# EasyEDA Pro project 能量机关测试板.eprj

# Schematic Schematic1
Create Date: 2023-03-18; Page Name: P1; Project Name: 能量机关测试板; Schematic Name: Schematic1; Update Date: 2023-03-19; Company: 嘉立创EDA; Page Size: A3; Version: V1.0
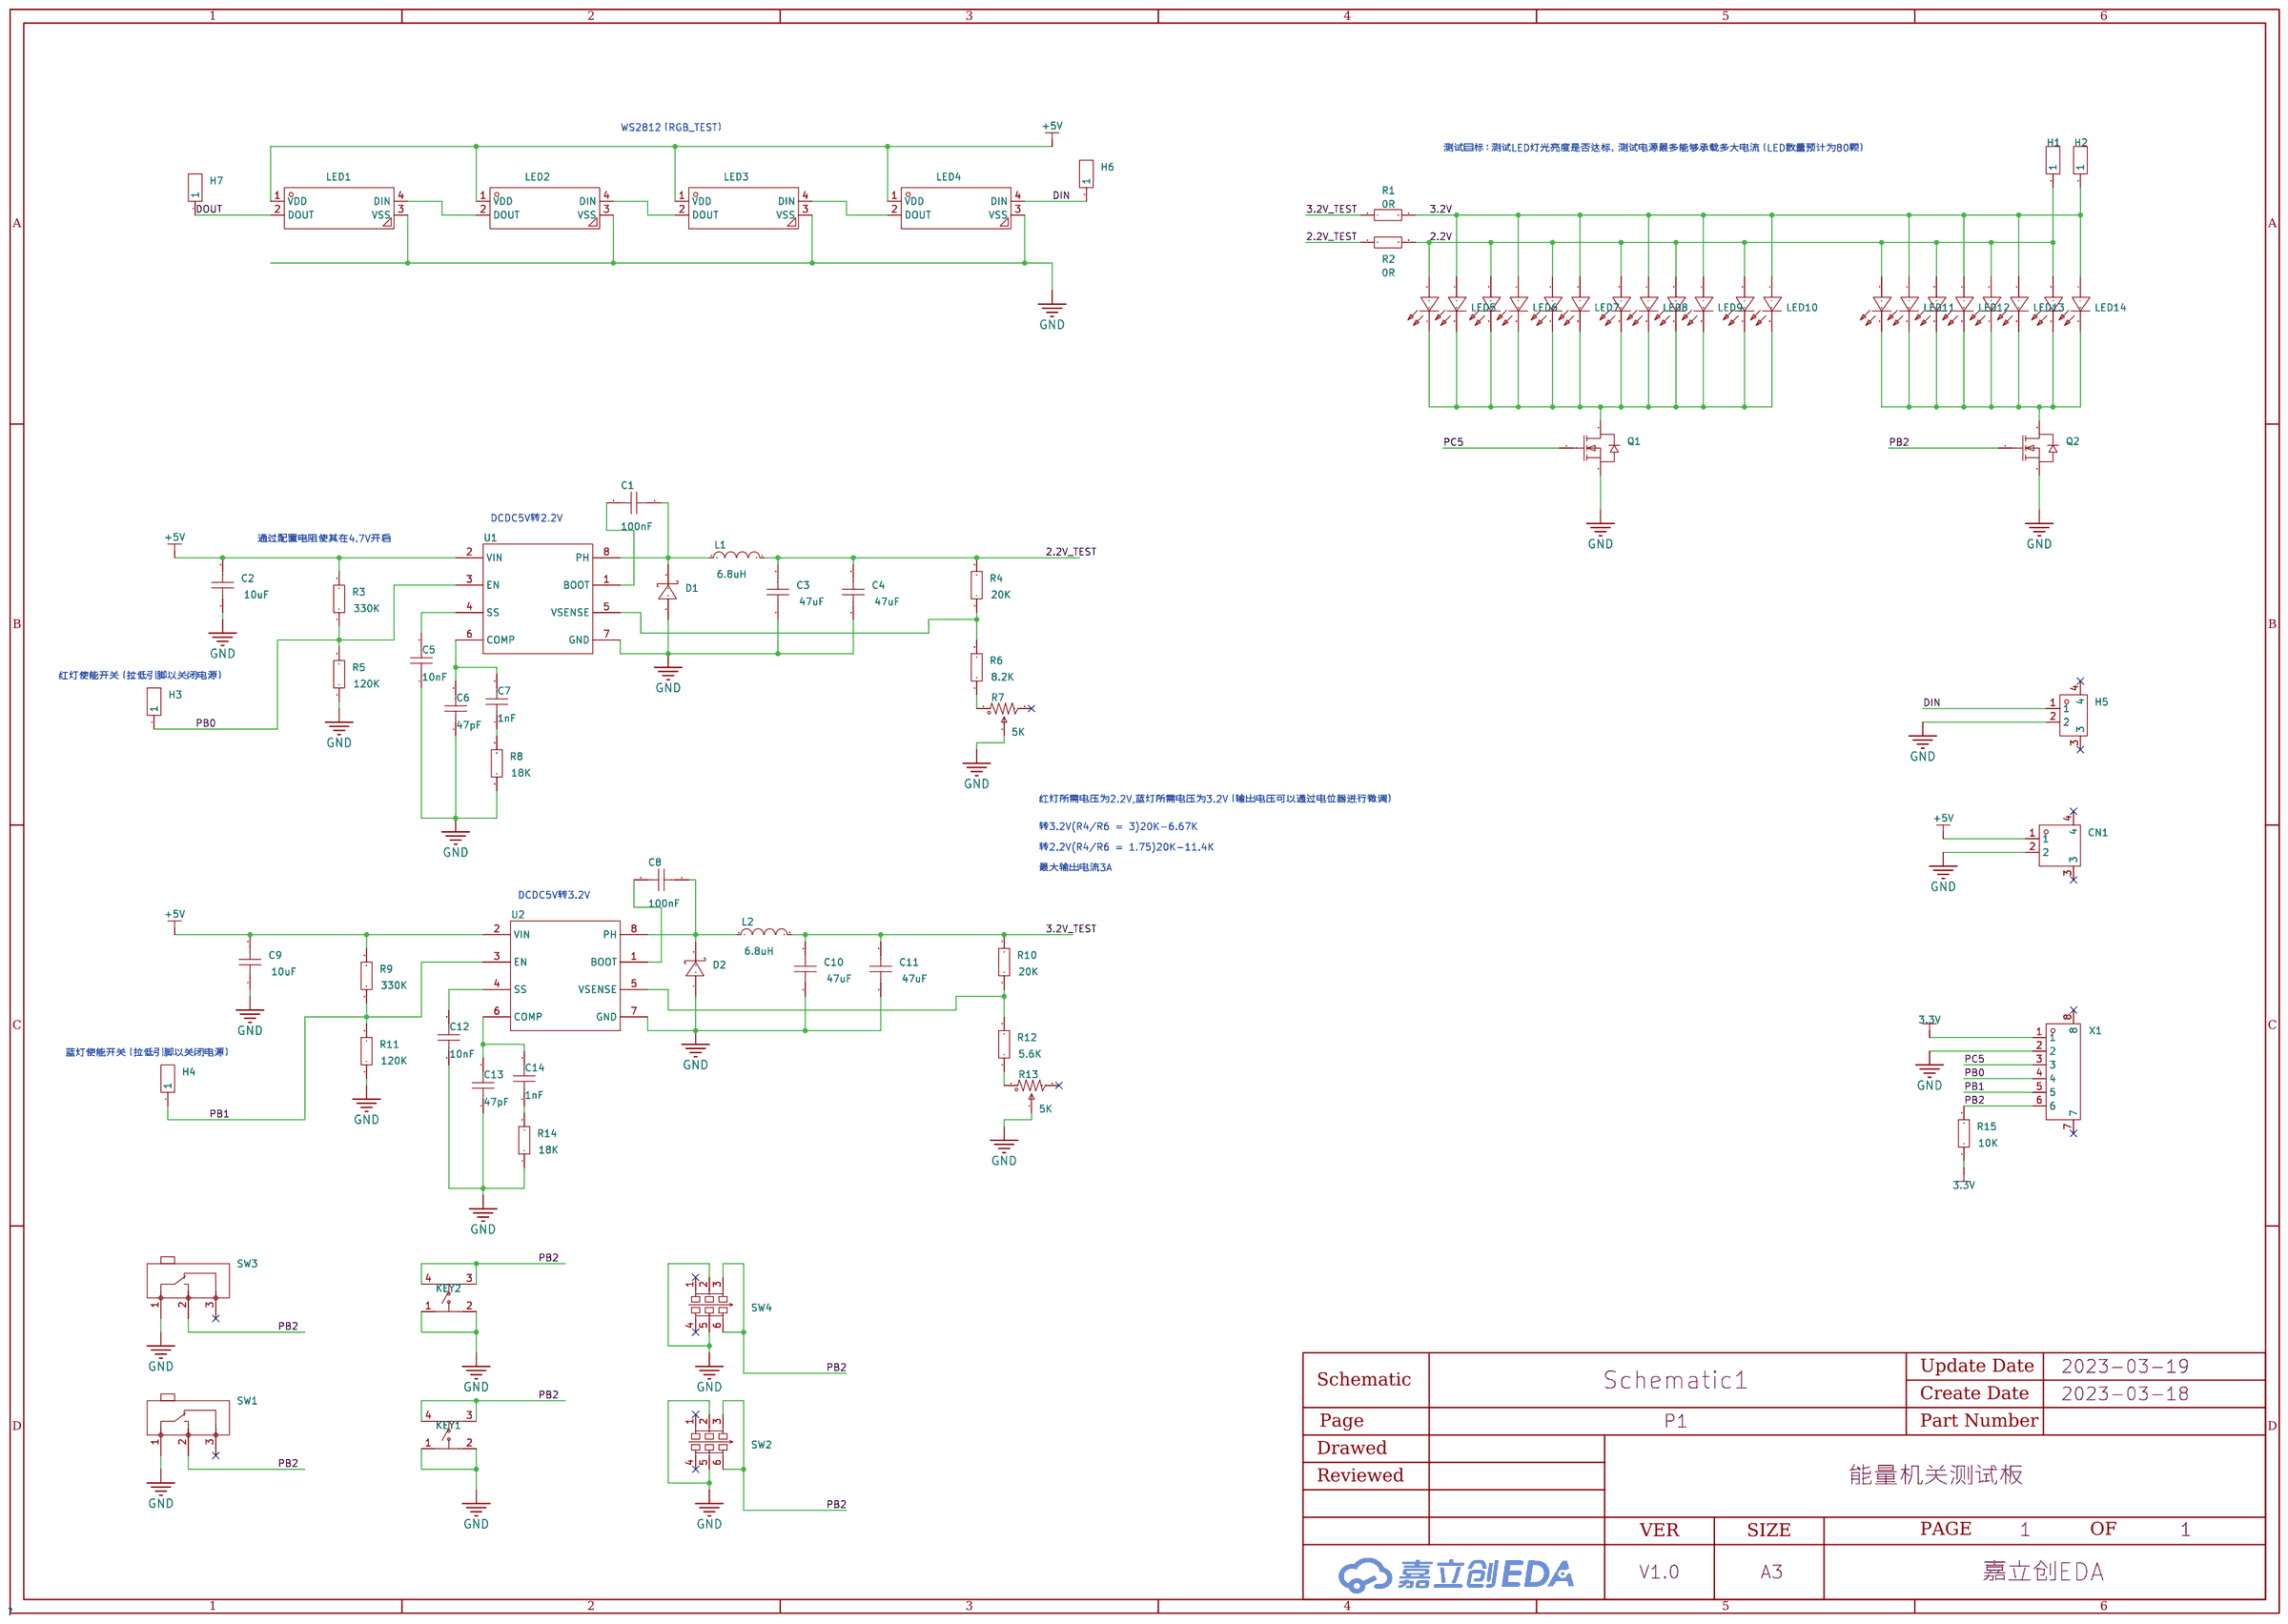
[diagram p0: schematic sheet]

## Parts
C1  100nF  [C0603]
C2  10uF  [C0603]
C3  47uF  [C1206]
C4  47uF  [C1206]
C5  10nF  [C0603]
C6  47pF  [C0603]
C7  1nF  [C0603]
C8  100nF  [C0603]
C9  10uF  [C0603]
C10  47uF  [C1206]
C11  47uF  [C1206]
C12  10nF  [C0603]
C13  47pF  [C0603]
C14  1nF  [C0603]
CN1  XT30PW-M  [CONN-TH_XT30PW-M]
D1  SS54  [SMA_L4.4-W2.8-LS5.4-R-RD]
D2  SS54  [SMA_L4.4-W2.8-LS5.4-R-RD]
H1  -  [HDR-TH_1P-V-M_XKB_X4611WV-01I-C28D40]
H2  -  [HDR-TH_1P-V-M_XKB_X4611WV-01I-C28D40]
H3  -  [HDR-TH_1P-V-M_XKB_X4611WV-01I-C28D40]
H4  -  [HDR-TH_1P-V-M_XKB_X4611WV-01I-C28D40]
H5  GH1.25-2PWBPZ  [CONN-SMD_GH1.25-2PWBPZ]
H6  -  [HDR-TH_1P-V-M_XKB_X4611WV-01I-C28D40]
H7  -  [HDR-TH_1P-V-M_XKB_X4611WV-01I-C28D40]
KEY1  B3F-4055  [KEY-TH_4P-L12.0-W12.0-P5.00-LS13.4-EH]
KEY2  B3F-4055  [KEY-TH_4P-L12.0-W12.0-P5.00-LS13.4-EH]
L1  6.8uH  [IND-SMD_L4.4-W4.2]
L2  6.8uH  [IND-SMD_L4.4-W4.2]
LED1  WS2812E  [LED-SMD_4P-L5.0-W5.0-BL_TC5050RGB]
LED2  WS2812E  [LED-SMD_4P-L5.0-W5.0-BL_TC5050RGB]
LED3  WS2812E  [LED-SMD_4P-L5.0-W5.0-BL_TC5050RGB]
LED4  WS2812E  [LED-SMD_4P-L5.0-W5.0-BL_TC5050RGB]
LED5  XL-3528SURUBC  [LED-SMD_4P-L3.2-W2.8-LS3.5-TL]
LED6  XL-3528SURUBC  [LED-SMD_4P-L3.2-W2.8-LS3.5-TL]
LED7  XL-3528SURUBC  [LED-SMD_4P-L3.2-W2.8-LS3.5-TL]
LED8  XL-3528SURUBC  [LED-SMD_4P-L3.2-W2.8-LS3.5-TL]
LED9  XL-3528SURUBC  [LED-SMD_4P-L3.2-W2.8-LS3.5-TL]
LED10  XL-3528SURUBC  [LED-SMD_4P-L3.2-W2.8-LS3.5-TL]
LED11  XL-3528SURUBC  [LED-SMD_4P-L3.2-W2.8-LS3.5-TL]
LED12  XL-3528SURUBC  [LED-SMD_4P-L3.2-W2.8-LS3.5-TL]
LED13  XL-3528SURUBC  [LED-SMD_4P-L3.2-W2.8-LS3.5-TL]
LED14  XL-3528SURUBC  [LED-SMD_4P-L3.2-W2.8-LS3.5-TL]
Q1  AO3400A  [SOT-23-3_L2.9-W1.6-P1.90-LS2.8-BR]
Q2  AO3400A  [SOT-23-3_L2.9-W1.6-P1.90-LS2.8-BR]
R1  0R  [R0805]
R2  0R  [R0805]
R3  330K  [R0603]
R4  20K  [R0603]
R5  120K  [R0603]
R6  8.2K  [R0603]
R7  5K  [RES-ADJ-SMD_3P-L3.0-W3.8-P1.75-BR]
R8  18K  [R0603]
R9  330K  [R0603]
R10  20K  [R0603]
R11  120K  [R0603]
R12  5.6K  [R0603]
R13  5K  [RES-ADJ-SMD_3P-L3.0-W3.8-P1.75-BR]
R14  18K  [R0603]
R15  10K  [R0603]
SW1  D2F-F  [SW-TH_D2F-F]
SW2  BTSA-L-P-16  [SW-TH_BTSA-X-P-16]
SW3  D2F-F  [SW-TH_D2F-F]
SW4  BTSA-L-P-16  [SW-TH_BTSA-X-P-16]
U1  TPS54331DR  [SOIC-8_L5.0-W4.0-P1.27-LS6.0-BL]
U2  TPS54331DR  [SOIC-8_L5.0-W4.0-P1.27-LS6.0-BL]
X1  GH125-S06DCA-00  [CONN-SMD_6P-P1.25_JUSHUO_GH125-S06DCA-00]

## Library data of the parts
C1 C5-C9 C12-C14 = CAP_0603: Supplier Footprint: 0603
C2 = CL10A106MA8NRNC: 容值:10uF;精度:±20%;额定电压:25V;材质(温度系数):X5R;; LCSC Part Name: 10uF ±20% 25V; Supplier Part: C96446; Manufacturer: SAMSUNG(三星); Supplier Footprint: 0603; JLCPCB Part Class: Basic Part; Datasheet: https://atta.szlcsc.com/upload/public/pdf/source/20170325/1490427913016.pdf; Supplier: LCSC; Tolerance: ±20%; Voltage Rated: 25V; Temperature Coefficient: X5R
C3 C4 C10 C11 = CL31A476MPHNNNE: 容值:47uF;精度:±20%;额定电压:10V;材质(温度系数):X5R;; LCSC Part Name: 47uF ±20% 10V; Supplier Part: C96123; Manufacturer: SAMSUNG(三星); Supplier Footprint: 1206; JLCPCB Part Class: Basic Part; Datasheet: https://atta.szlcsc.com/upload/public/pdf/source/20170228/1488267692219.pdf; Supplier: LCSC; Tolerance: ±20%; Voltage Rated: 10V; Temperature Coefficient: X5R
CN1 = XT30PW-M: Socket,DCsupply,XT30,male,PIN:2; LCSC Part Name: XT30PW-M公头; Supplier Part: C431092; Manufacturer: AMASS(艾迈斯); Supplier Footprint: 插件; JLCPCB Part Class: Extended Part; Datasheet: https://atta.szlcsc.com/upload/public/pdf/source/20220222/6A9F22F7850E25B33E1BE430ADF8560B.pdf; Supplier: LCSC
D1 D2 = SS54_C22452: 直流反向耐压(Vr):40V;平均整流电流(Io):5A;正向压降(Vf):550mV@5A;; LCSC Part Name: 40V 5A 550mV@5A; Supplier Part: C22452; Manufacturer: MDD; Supplier Footprint: SMA(DO-214AC); JLCPCB Part Class: Basic Part; Datasheet: https://atta.szlcsc.com/upload/public/pdf/source/20230314/529CD85F9B31F69841D3A079BC07E377.pdf; Supplier: LCSC; Reverse Voltage (Vr): 40V; Average Rectified Current (Io): 5A; Forward Voltage (Vf@If): 550mV@5A
H1-H4 H6 H7 = HDR-M_2.54_1x1P: Supplier Part: C81276; Supplier Footprint: 插件; JLCPCB Part Class: Extended Part
H5 = GH1.25-2PWBPZ: LCSC Part Name: GH1.25-2P卧贴编带; Supplier Part: C2829251; Manufacturer: BOOMELE(博穆精密); JLCPCB Part Class: Extended Part; Datasheet: https://atta.szlcsc.com/upload/public/pdf/source/20211125/08A09A4909F58AF780B71FE423A00F7E.pdf; Supplier: LCSC
KEY1 KEY2 = B3F-4055_C84931: 触点电流:50mA;额定电压(DC):24V;电路结构:单刀单掷;安装方式:直插;按钮形状:方形按钮;带灯:-;开关长度:12mm;开关宽度:12mm;开关高度:7.3mm;; LCSC Part Name: 轻触开关，1212x7.3，操作力:2.55N，行程:0.3mm; Supplier Part: C84931; Manufacturer: OMRON(欧姆龙); Supplier Footprint: 插件; JLCPCB Part Class: Extended Part; Datasheet: https://atta.szlcsc.com/upload/public/pdf/source/20161024/1477288679265.pdf; Supplier: LCSC; Contact Current: 50mA; Voltage Rating (DC): 24V; Circuit: 单刀单掷; Mounting Style: 直插; Actuator Style: 方形按钮; Switch Length: 12mm; Switch Width: 12mm; Switch Height: 7.3mm
L1 L2 = SLO0420H6R8MTT: 电感值:6.8uH;精度:±20%;额定电流:-;直流电阻(DCR):-;; LCSC Part Name: 6.8uH ±20%; Supplier Part: C207831; Manufacturer: Sunltech(韩国顺磁); Supplier Footprint: SMD; JLCPCB Part Class: Extended Part; Datasheet: https://atta.szlcsc.com/upload/public/pdf/source/20181213/C207831_9CE68140B4A4D6C1F5B22F7A0B1543CF.pdf; Supplier: LCSC; Tolerance: ±20%
LED1-LED4 = WS2812E: 发光颜色:RGB三色;透镜颜色:无色透明;; LCSC Part Name: RGB三色 （注意防潮，请查阅规格书中对应具体内容）; Supplier Part: C139127; Manufacturer: worldsemi; Supplier Footprint: SMD5050; JLCPCB Part Class: Extended Part; Datasheet: https://atta.szlcsc.com/upload/public/pdf/source/20190919/C139127_8A00227E116D2190DD4F641BBD4AB378.pdf; Supplier: LCSC; Emitted Color: RGB三色; Lens Color: 无色透明
LED5-LED14 = XL-3528SURUBC: 发光颜色:红灯,蓝灯;二极管配置:-;透镜颜色:无色透明;主波长:462.5nm~465nm；620nm~625nm;峰值波长:625nm；465nm;测试电流:30mA;功率:90mW；90mW;发光角度:120°;安装方式:正贴;工作温度:-30℃~+85℃;; LCSC Part Name: 红灯,蓝灯 462.5nm~465nm 620nm~625nm 正贴 （同极性脚位）; Supplier Part: C2843811; Manufacturer: XINGLIGHT(成兴光); Supplier Footprint: SMD3528; JLCPCB Part Class: Extended Part; Datasheet: https://atta.szlcsc.com/upload/public/pdf/source/20221102/213A0B15308BC841DAD2CFA01F42E005.pdf; Supplier: LCSC; Emitted Color: 红灯,蓝灯; Lens Color: 无色透明; Dominant Wavelength: 462.5nm~465nm；620nm~625nm; Peak Wavelength: 625nm；465nm; Forward Current: 30mA; Power Dissipation: 90mW；90mW; Viewing Angle: 120°; Mounting Sytle: 正贴; Operating Temperature: -30℃~+85℃
Q1 Q2 = AO3400A_C20917: 类型:N沟道;漏源电压(Vdss):30V;连续漏极电流(Id):5.7A;功率(Pd):1.4W;导通电阻(RDS(on)@Vgs,Id):26.5mΩ@10V,5.7A;阈值电压(Vgs(th)@Id):1.5V@250uA;; LCSC Part Name: N沟道 30V 5.7A; Supplier Part: C20917; Manufacturer: AOS; Supplier Footprint: SOT-23-3L; JLCPCB Part Class: Basic Part; Datasheet: https://atta.szlcsc.com/upload/public/pdf/source/20140107/1457706668533.pdf; Supplier: LCSC; Type: N沟道; Drain Source Voltage (Vdss): 30V; Continuous Drain Current (Id): 5.7A; Power Dissipation (Pd): 1.4W; Drain Source On Resistance (RDS(on)@Vgs,Id): 26.5mΩ@10V,5.7A; Gate Threshold Voltage (Vgs(th)@Id): 1.5V@250uA
R1 R2 = Res_0805: Supplier Footprint: 0805
R3-R6 R8-R12 R14 R15 = Res_0603: Supplier Footprint: 0603
R7 R13 = TC33X-2-103E: 阻值:10kΩ;精度:±25%;功率:150mW;圈数:-;额定电压:-;; LCSC Part Name: 10kΩ ±25%; Supplier Part: C719176; Manufacturer: BOURNS; Supplier Footprint: SMD; JLCPCB Part Class: Extended Part; Datasheet: https://atta.szlcsc.com/upload/public/pdf/source/20200810/C720646_BB66A75E654D5E1D30127FF45BCD3C26.pdf; Supplier: LCSC; Tolerance: ±25%; Power(Watts): 150mW
SW1 SW3 = D2F-F: 额定电流(DC):-;额定电压(DC):-;额定电流(AC):1A;额定电压(AC):125V;电路结构:单刀双掷;; LCSC Part Name: D2F-F/微动开关; Supplier Part: C87496; Manufacturer: OMRON(欧姆龙); Supplier Footprint: 插件; JLCPCB Part Class: Extended Part; Datasheet: https://atta.szlcsc.com/upload/public/pdf/source/20170221/1487673193635.pdf; Supplier: LCSC; Contact Current (AC): 1A; Voltage Rating (AC): 125V; Circuit: 单刀双掷
SW2 SW4 = BTSA-L-P-16: 触点电流:100mA;额定电压 (AC):-;额定电压 (DC):-;绝缘电阻:100MΩ;电路结构:-;安装方式:直插;自锁/无锁:自锁;按键形状:方形按钮;按键/盖帽颜色:蓝色;带灯:无;引脚样式:PC引脚;作用力:250gf@±50gf;防护等级:-;工作温度:-20℃~+70℃;机械寿命:10000;; Supplier Part: C2693640; Manufacturer: ROCPU Switches(台普); Supplier Footprint: 插件; JLCPCB Part Class: Extended Part; Datasheet: https://atta.szlcsc.com/upload/public/pdf/source/20210317/C2693625_B3D83B78D2512AD179A7F987F25D7A8F.pdf; Supplier: LCSC; Contact Current: 100mA; Insulation Resistance: 100MΩ; Mounting Style: 直插; Self Lock / No Lock: 自锁; Actuator Style: 方形按钮; Actuator/Cap Color: 蓝色; With Lamp: 无; Pin Style: PC引脚; Operating Force: 250gf@±50gf; Operating Temperature: -20℃~+70℃; Mechanical Life: 10000
U1 U2 = TPS54331DR: 功能类型:降压型;同步整流:-;输出通道数:-;拓扑结构:-;输入电压:-;输出电流(最大值):-;开关频率:-;; LCSC Part Name: 降压型; Supplier Part: C9865; Manufacturer: TI(德州仪器); Supplier Footprint: SOIC-8-150mil; JLCPCB Part Class: Basic Part; Datasheet: https://atta.szlcsc.com/upload/public/pdf/source/20121112/1457706556448.pdf; Supplier: LCSC; Function: 降压型
X1 = GH125-S06DCA-00: 参考系列:GH;间距:1.25mm;插针结构:1x6P;排数:1;每排PIN数:6;行距:-;公母:公型插针;安装方式:卧贴;额定电流:1A;工作温度范围:-25℃~+85℃;; LCSC Part Name: GH1.25卧式贴片 带扣; Supplier Part: C2886769; Manufacturer: JS(钜硕电子); Supplier Footprint: SMD,P=1.25mm; JLCPCB Part Class: Extended Part; Datasheet: https://atta.szlcsc.com/upload/public/pdf/source/20210818/CD11791E5ED3EDF45A7009E9C8A2BD4C.pdf; Supplier: LCSC; Reference Series: GH; Pitch: 1.25mm; Pins Structure: 1x6P; Number of Rows: 1; Number of PINs Per Row: 6; Gender: 公型插针; Mounting Style: 卧贴; Current Rating (Max): 1A; Operating Temperature Range: -25℃~+85℃

## Nets
2.2V: H1.1 LED5.2 LED6.2 LED7.2 LED8.2 LED9.2 LED10.2 LED11.2 LED12.2 LED13.2 LED14.2 R2.2
2.2V_TEST: C3.2 C4.2 L1.2 R2.1 R4.2
3.2V: H2.1 LED5.4 LED6.4 LED7.4 LED8.4 LED9.4 LED10.4 LED11.4 LED12.4 LED13.4 LED14.4 R1.2
3.2V_TEST: C10.2 C11.2 L2.2 R1.1 R10.2
3.3V: R15.1 X1.1
+5V: C2.2 C9.2 CN1.1 LED1.1(VDD) LED2.1(VDD) LED3.1(VDD) LED4.1(VDD) R3.2 R9.2 U1.2(VIN) U2.2(VIN)
GND: C2.1 C3.1 C4.1 C5.1 C6.1 C9.1 C10.1 C11.1 C12.1 C13.1 CN1.2 D1.1(A) D2.1(A) H5.2 KEY1.1 KEY1.2 KEY2.1 KEY2.2 LED1.3(VSS) LED2.3(VSS) LED3.3(VSS) LED4.3(VSS) Q1.2(S) Q2.2(S) R5.1 R7.2 R8.1 R11.1 R13.2 R14.1 SW1.1 SW2.2 SW2.5 SW3.1 SW4.2 SW4.5 U1.7(GND) U2.7(GND) X1.2
DIN: H5.1 H6.1 LED4.4(DIN)
DOUT: H7.1 LED1.2(DOUT)
PB0: H3.1 R3.1 R5.2 U1.3(EN) X1.4
PB1: H4.1 R9.1 R11.2 U2.3(EN) X1.5
PB2: KEY1.3 KEY1.4 KEY2.3 KEY2.4 Q2.1(G) R15.2 SW1.2 SW2.3 SW2.6 SW3.2 SW4.3 SW4.6 X1.6
PC5: Q1.1(G) X1.3
$1N7140: LED1.4(DIN) LED2.2(DOUT)
$1N7163: LED2.4(DIN) LED3.2(DOUT)
$1N7186: LED3.4(DIN) LED4.2(DOUT)
$1N21476: C5.2 U1.4(SS)
$1N21483: R4.1 R6.2 U1.5(VSENSE)
$1N21484: C1.2 U1.1(BOOT)
$1N21485: C1.1 D1.2(K) L1.1 U1.8(PH)
$1N21486: R6.1 R7.1
$1N21488: C6.2 C7.2 U1.6(COMP)
$1N21489: C7.1 R8.2
$1N22401: C12.2 U2.4(SS)
$1N22408: R10.1 R12.2 U2.5(VSENSE)
$1N22409: C8.2 U2.1(BOOT)
$1N22410: C8.1 D2.2(K) L2.1 U2.8(PH)
$1N22411: R12.1 R13.1
$1N22413: C13.2 C14.2 U2.6(COMP)
$1N22414: C14.1 R14.2
$1N27439: LED5.1 LED5.3 LED6.1 LED6.3 LED7.1 LED7.3 LED8.1 LED8.3 LED9.1 LED9.3 LED10.1 LED10.3 Q1.3(D)
$1N27600: LED11.1 LED11.3 LED12.1 LED12.3 LED13.1 LED13.3 LED14.1 LED14.3 Q2.3(D)

Not connected (* = marked no-connect by the designer): CN1 3* 4*; H5 3* 4*; R7 3*; R13 3*; SW1 3*; SW2 1* 4*; SW3 3*; SW4 1* 4*; X1 7* 8*

## Notes on the sheet
- WS2812（RGB_TEST）
- 测试目标：测试LED灯光亮度是否达标，测试电源最多能够承载多大电流（LED数量预计为80颗）
- DCDC5V转2.2V
- 通过配置电阻使其在4.7V开启
- 红灯使能开关（拉低引脚以关闭电源）
- 红灯所需电压为2.2V,蓝灯所需电压为3.2V（输出电压可以通过电位器进行微调）
- 转3.2V(R4/R6 = 3)20K-6.67K
- 转2.2V(R4/R6 = 1.75)20K-11.4K
- 最大输出电流3A
- DCDC5V转3.2V
- 蓝灯使能开关（拉低引脚以关闭电源）

# Board PCB1
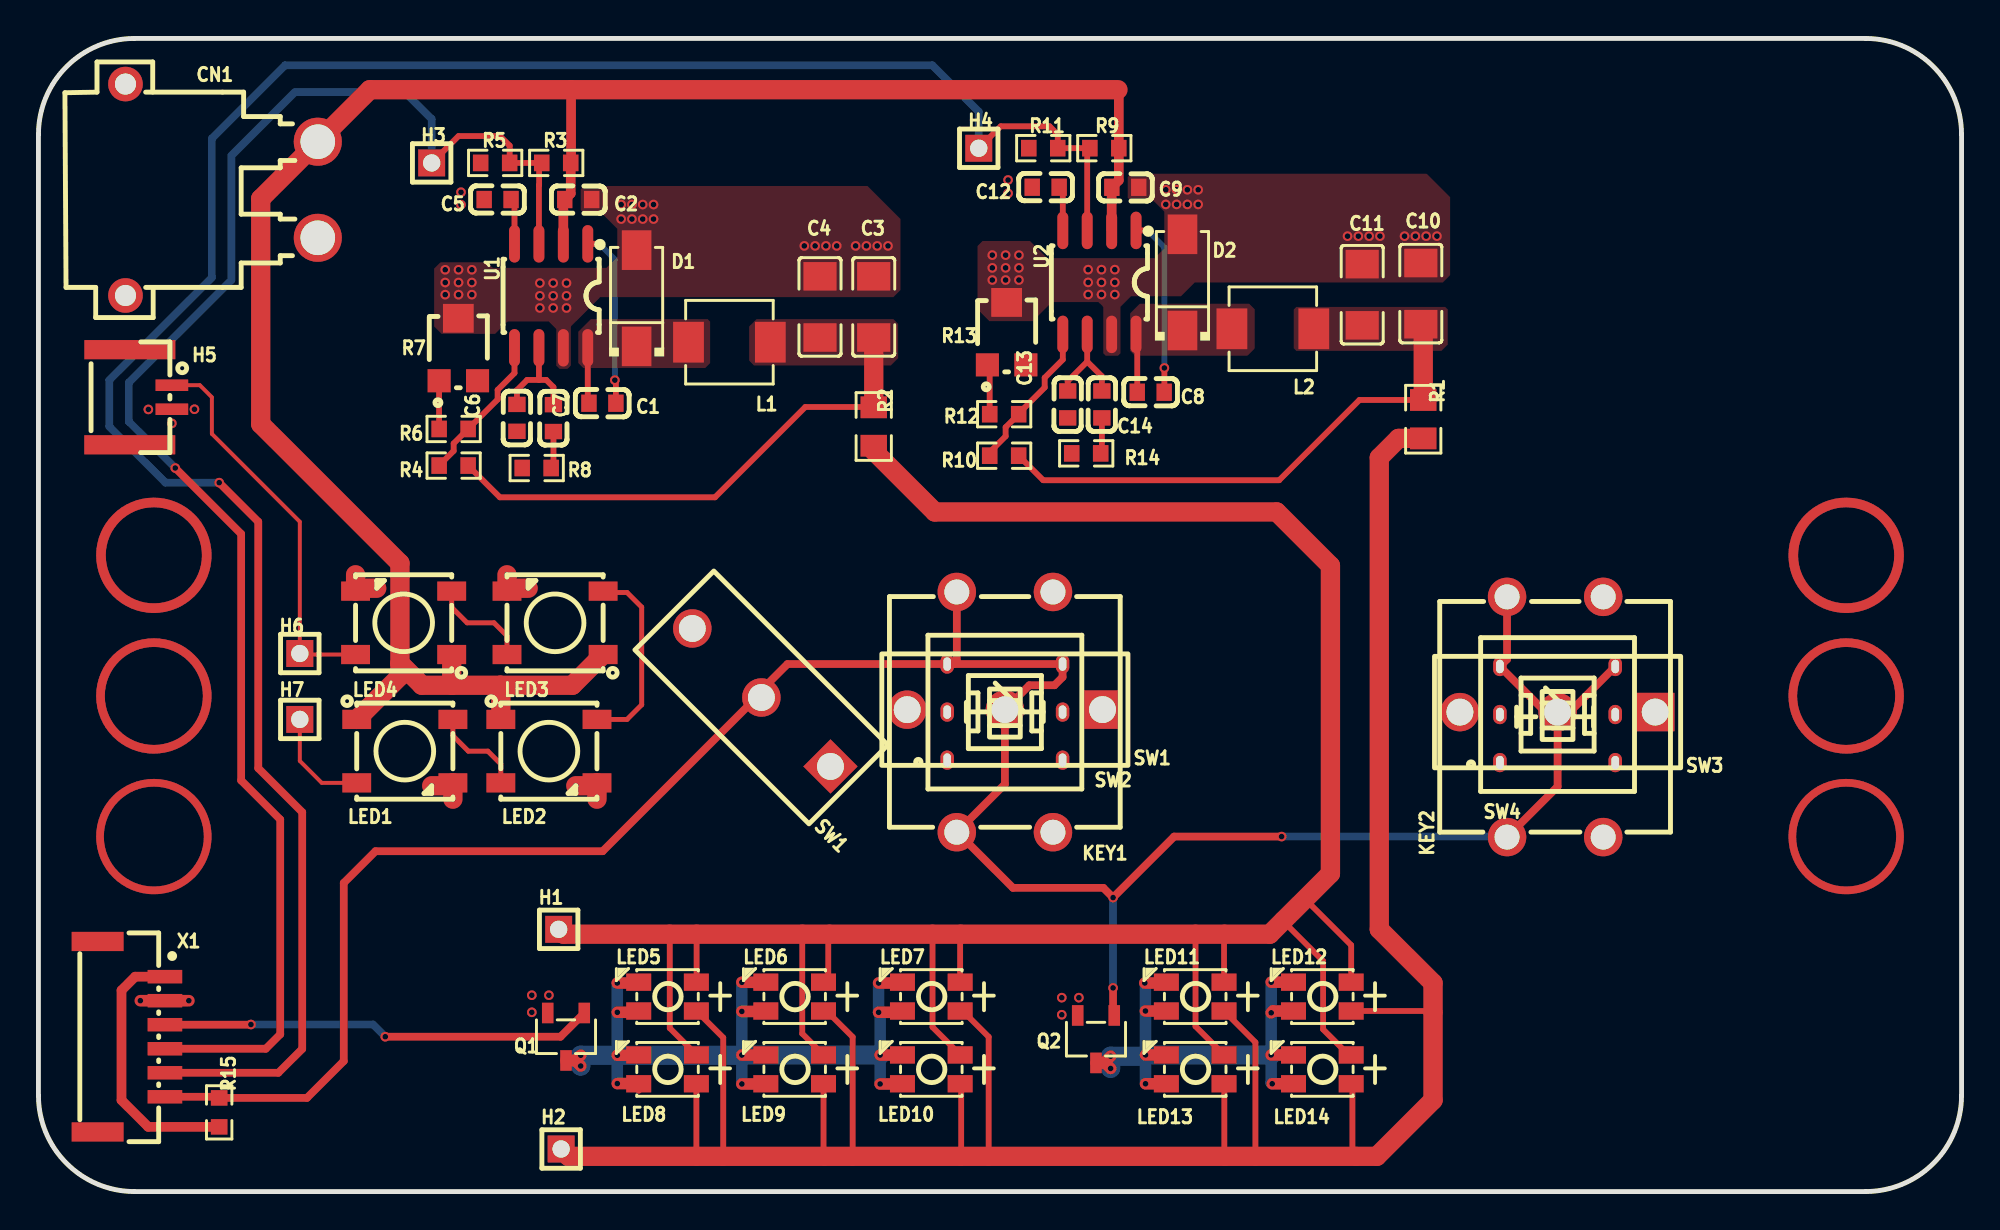
[diagram p1: board, top side]
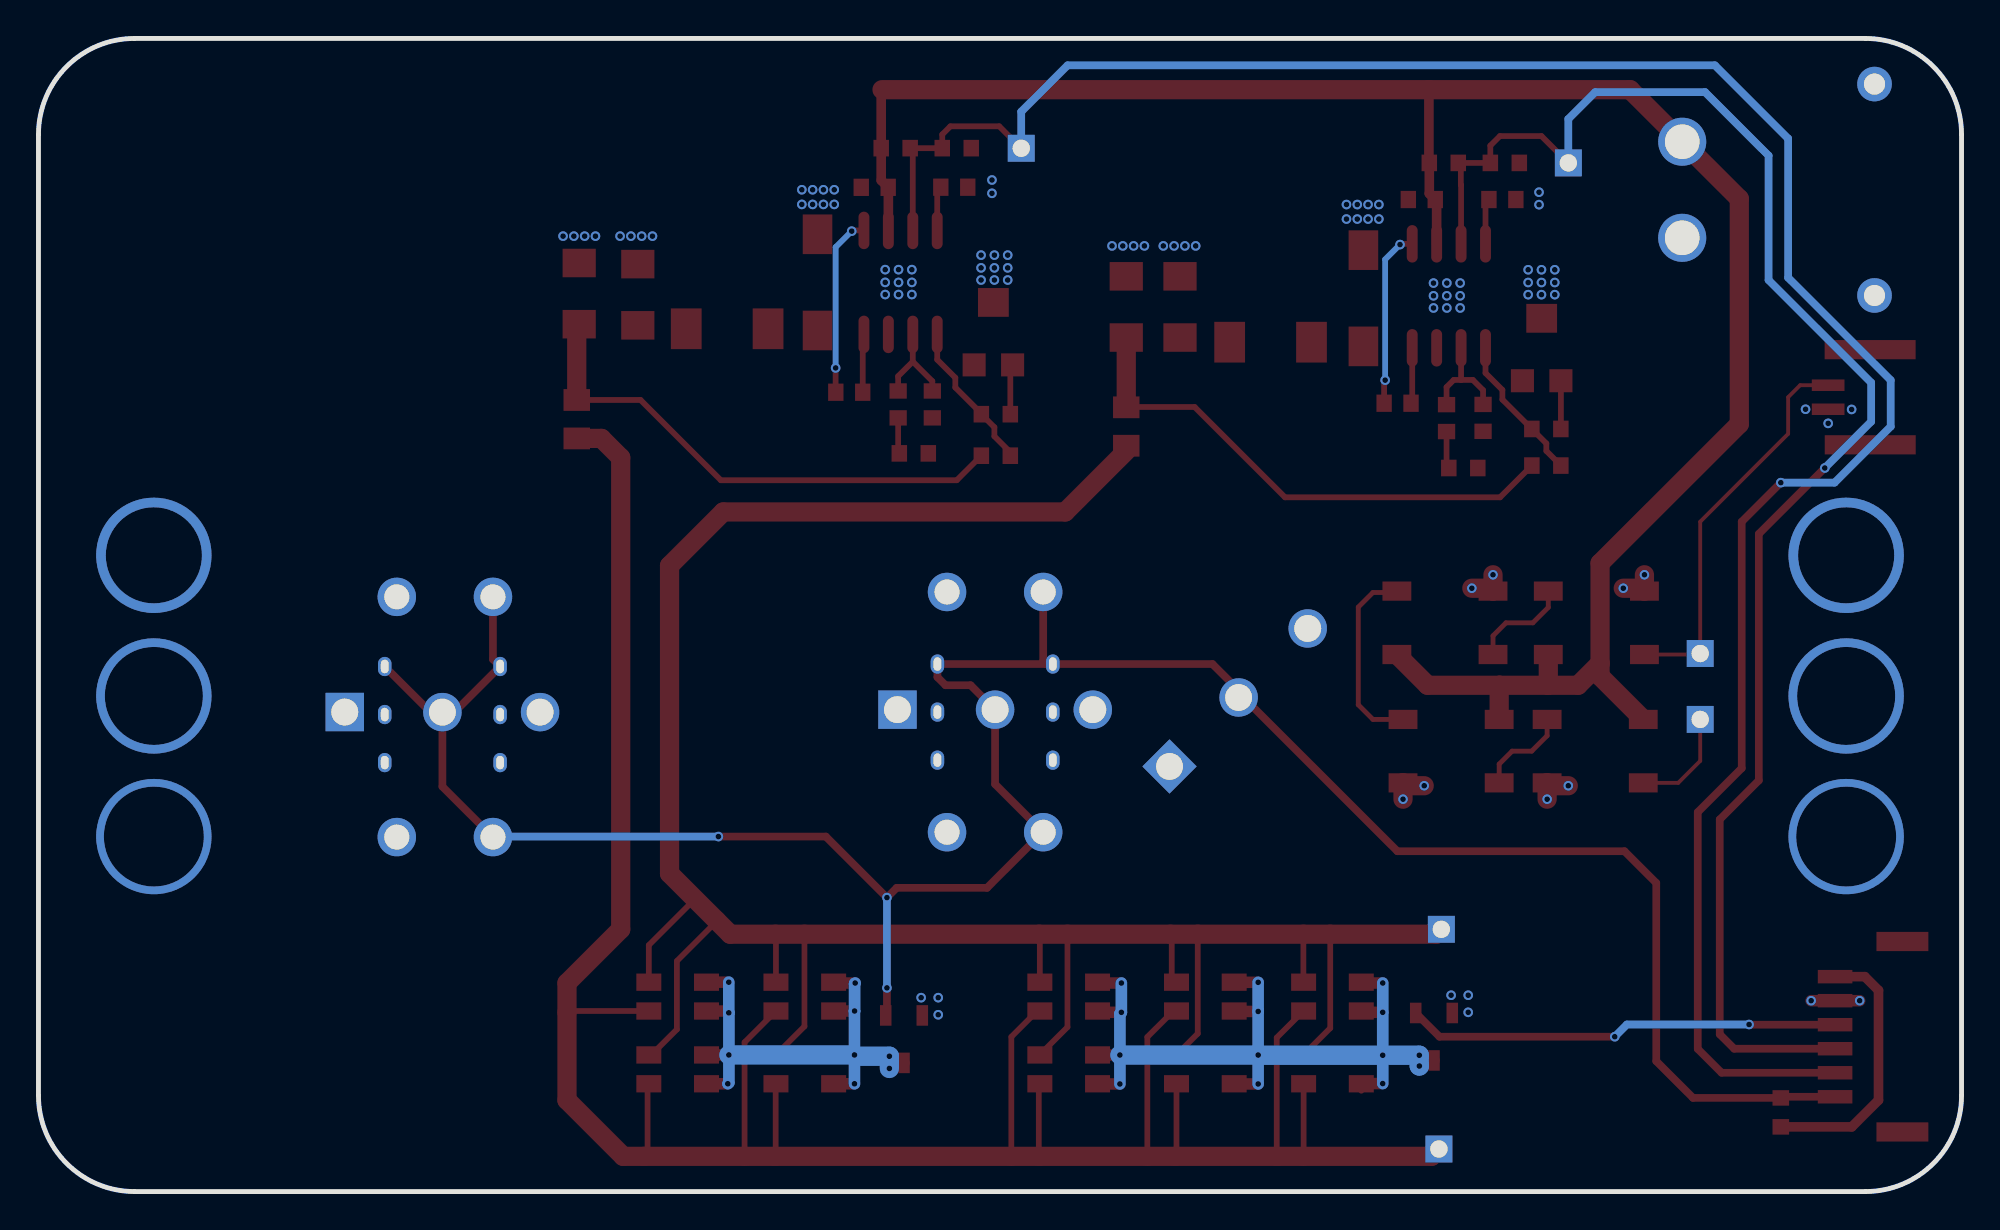
[diagram p2: board, bottom side, seen from below]

Outline 100 x 60 mm; copper layers: Top Layer, Bottom Layer. Coordinates in mm from the lower left corner of the outline.
Outline path: 0,55 0,5 arc(1.46,1.46) 5,0 95,0 arc(98.54,1.46) 100,5 100,55 arc(98.54,58.54) 95,60 5,60 arc(1.46,58.54) 0,55
Stack: Top Layer 0.035mm / Dielectric1 1.51mm FR4 er 4.5 / Bottom Layer 0.035mm

## Design rules (mm)
spacing safeClearance (default): track to track 0.152, other pairs 0.152 to 0.3
track width trackWidth (default): min 0.127, default 0.254, max 2.54
differential pair differentialPair (default): width min 0.127, default 0.254, max 2.54; gap min 0.152, default 0.152
via viaSize (default): diameter min 0.5, default 0.61, max 10; hole min 0.3, default 0.305, max 6

## Placement (name value [footprint] x y rotation side)
C1  100nF  [C0603]  29.33 41.02 0 top
C2  10uF  [C0603]  28.07 51.62 180 top
C3  47uF  [C1206]  43.43 46.03 270 top
C4  47uF  [C1206]  40.64 46.03 270 top
C5  10nF  [C0603]  23.88 51.62 0 top
C6  47pF  [C0603]  24.88 40.26 90 top
C7  1nF  [C0603]  26.78 40.25 90 top
C8  100nF  [C0603]  57.84 41.59 0 top
C9  10uF  [C0603]  56.51 52.25 180 top
C10  47uF  [C1206]  71.88 46.72 270 top
C11  47uF  [C1206]  68.83 46.67 270 top
C12  10nF  [C0603]  52.38 52.26 0 top
C13  47pF  [C0603]  53.52 40.96 90 top
C14  1nF  [C0603]  55.3 40.96 90 top
CN1  XT30PW-M  [CONN-TH_XT30PW-M]  9.53 52.13 270 top
D1  SS54  [SMA_L4.4-W2.8-LS5.4-R-RD]  31.1 46.48 90 top
D2  SS54  [SMA_L4.4-W2.8-LS5.4-R-RD]  59.49 47.31 90 top
H1  -  [HDR-TH_1P-V-M_XKB_X4611WV-01I-C28D40]  27.05 13.64 0 top
H2  -  [HDR-TH_1P-V-M_XKB_X4611WV-01I-C28D40]  27.18 2.22 0 top
H3  -  [HDR-TH_1P-V-M_XKB_X4611WV-01I-C28D40]  20.45 53.52 270 top
H4  -  [HDR-TH_1P-V-M_XKB_X4611WV-01I-C28D40]  48.9 54.28 270 top
H5  GH1.25-2PWBPZ  [CONN-SMD_GH1.25-2PWBPZ]  5.33 41.33 270 top
H6  -  [HDR-TH_1P-V-M_XKB_X4611WV-01I-C28D40]  13.59 28 0 top
H7  -  [HDR-TH_1P-V-M_XKB_X4611WV-01I-C28D40]  13.59 24.57 0 top
KEY1  B3F-4055  [KEY-TH_4P-L12.0-W12.0-P5.00-LS13.4-EH]  50.25 24.95 90 top
KEY2  B3F-4055  [KEY-TH_4P-L12.0-W12.0-P5.00-LS13.4-EH]  78.87 24.69 90 top
L1  6.8uH  [IND-SMD_L4.4-W4.2]  35.93 44.19 180 top
L2  6.8uH  [IND-SMD_L4.4-W4.2]  64.19 44.89 180 top
LED1  WS2812E  [LED-SMD_4P-L5.0-W5.0-BL_TC5050RGB]  19.05 22.92 0 top
LED2  WS2812E  [LED-SMD_4P-L5.0-W5.0-BL_TC5050RGB]  26.54 22.92 0 top
LED3  WS2812E  [LED-SMD_4P-L5.0-W5.0-BL_TC5050RGB]  26.86 29.59 180 top
LED4  WS2812E  [LED-SMD_4P-L5.0-W5.0-BL_TC5050RGB]  18.99 29.59 180 top
LED5  XL-3528SURUBC  [LED-SMD_4P-L3.2-W2.8-LS3.5-TL]  32.71 10.15 0 top
LED6  XL-3528SURUBC  [LED-SMD_4P-L3.2-W2.8-LS3.5-TL]  39.32 10.15 0 top
LED7  XL-3528SURUBC  [LED-SMD_4P-L3.2-W2.8-LS3.5-TL]  46.43 10.15 0 top
LED8  XL-3528SURUBC  [LED-SMD_4P-L3.2-W2.8-LS3.5-TL]  32.71 6.36 0 top
LED9  XL-3528SURUBC  [LED-SMD_4P-L3.2-W2.8-LS3.5-TL]  39.32 6.36 0 top
LED10  XL-3528SURUBC  [LED-SMD_4P-L3.2-W2.8-LS3.5-TL]  46.43 6.36 0 top
LED11  XL-3528SURUBC  [LED-SMD_4P-L3.2-W2.8-LS3.5-TL]  60.15 10.15 0 top
LED12  XL-3528SURUBC  [LED-SMD_4P-L3.2-W2.8-LS3.5-TL]  66.76 10.15 0 top
LED13  XL-3528SURUBC  [LED-SMD_4P-L3.2-W2.8-LS3.5-TL]  60.15 6.36 0 top
LED14  XL-3528SURUBC  [LED-SMD_4P-L3.2-W2.8-LS3.5-TL]  66.76 6.36 0 top
Q1  AO3400A  [SOT-23-3_L2.9-W1.6-P1.90-LS2.8-BR]  27.43 8.06 90 top
Q2  AO3400A  [SOT-23-3_L2.9-W1.6-P1.90-LS2.8-BR]  54.99 7.93 90 top
R1  0R  [R0805]  72.01 40.19 270 top
R2  0R  [R0805]  43.43 39.81 270 top
R3  330K  [R0603]  26.92 53.52 0 top
R4  20K  [R0603]  21.59 37.78 0 top
R5  120K  [R0603]  23.75 53.52 0 top
R6  8.2K  [R0603]  21.59 39.68 0 top
R7  5K  [RES-ADJ-SMD_3P-L3.0-W3.8-P1.75-BR]  21.83 43.81 270 top
R8  18K  [R0603]  25.91 37.65 0 top
R9  330K  [R0603]  55.42 54.29 0 top
R10  20K  [R0603]  50.22 38.29 0 top
R11  120K  [R0603]  52.25 54.29 0 top
R12  5.6K  [R0603]  50.22 40.45 0 top
R13  5K  [RES-ADJ-SMD_3P-L3.0-W3.8-P1.75-BR]  50.34 44.64 270 top
R14  18K  [R0603]  54.48 38.41 0 top
R15  10K  [R0603]  9.4 4.12 90 top
SW1  D2F-F  [SW-TH_D2F-F]  50.25 25.08 180 top
SW1#2  -  [SW-TH_D2F-F]  37.59 25.71 135 top
SW2  BTSA-L-P-16  [SW-TH_BTSA-X-P-16]  50.25 24.95 90 top
SW3  D2F-F  [SW-TH_D2F-F]  78.99 24.95 180 top
SW4  BTSA-L-P-16  [SW-TH_BTSA-X-P-16]  78.99 24.82 90 top
U1  TPS54331DR  [SOIC-8_L5.0-W4.0-P1.27-LS6.0-BL]  26.66 46.61 180 top
U2  TPS54331DR  [SOIC-8_L5.0-W4.0-P1.27-LS6.0-BL]  55.17 47.31 180 top
X1  GH125-S06DCA-00  [CONN-SMD_6P-P1.25_JUSHUO_GH125-S06DCA-00]  4.83 8.06 270 top

## Footprints (pads in the part's own frame, mm; a bottom-side part is the same pattern mirrored in y, then rotated)
C0603
  rect 0.8x0.9 smd: 1(-0.7,0) 2(0.7,0)
C1206
  rect 1.485x1.728 smd: 1(-1.593,0) 2(1.593,0)
CONN-SMD_6P-P1.25_JUSHUO_GH125-S06DCA-00
  rect 0.7x1.8 smd: 1(-3.125,1.75) 2(-1.875,1.75) 3(-0.625,1.75) 4(0.625,1.75) 5(1.875,1.75) 6(3.125,1.75)
  rect 1x2.7 smd: 7(4.955,-1.75) 8(-4.955,-1.75)
CONN-SMD_GH1.25-2PWBPZ
  rect 0.6x1.7 smd: 1(-0.625,1.602) 2(0.625,1.602)
  rect 1x4.732 smd: 3(2.475,-0.587) 4(-2.475,-0.582)
CONN-TH_XT30PW-M
  round 2.5 hole 1.8: 1(-2.5,5) 2(2.5,5)
  round 1.8 hole 1.1: 3(5.5,-5) 4(-5.5,-5)
HDR-TH_1P-V-M_XKB_X4611WV-01I-C28D40
  rect 1.4x1.4 hole 0.9: 1(0,0)
IND-SMD_L4.4-W4.2
  rect 1.6x2.12 smd: 1(2.128,0) 2(-2.128,0)
KEY-TH_4P-L12.0-W12.0-P5.00-LS13.4-EH
  round 2 hole 1.3: 1(6.25,-2.5) 2(-6.25,-2.5) 3(6.25,2.5) 4(-6.25,2.5)
LED-SMD_4P-L3.2-W2.8-LS3.5-TL
  rect 1.3x0.9 smd: 1(-1.5,0.75) 2(1.5,0.75) 3(-1.5,-0.75) 4(1.5,-0.75)
LED-SMD_4P-L5.0-W5.0-BL_TC5050RGB
  rect 1.5x1 smd: 1(-2.5,1.65) 2(-2.5,-1.65) 3(2.5,-1.65) 4(2.5,1.65)
R0603
  rect 0.806x0.864 smd: 1(-0.753,0) 2(0.753,0)
R0805
  rect 1.133x1.377 smd: 1(-1,0) 2(1,0)
RES-ADJ-SMD_3P-L3.0-W3.8-P1.75-BR
  rect 1.2x1.2 smd: 1(1.625,-1) 3(1.625,1)
  rect 1.5x1.6 smd: 2(-1.625,0)
SMA_L4.4-W2.8-LS5.4-R-RD
  rect 2.062x1.539 smd: 1(2.503,0) 2(-2.503,0)
SOIC-8_L5.0-W4.0-P1.27-LS6.0-BL
  oval 0.569x1.95 smd: 1(-1.905,-2.705) 2(-0.635,-2.705) 3(0.635,-2.705) 4(1.905,-2.705) 5(1.905,2.705) 6(0.635,2.705) 7(-0.635,2.705) 8(-1.905,2.705)
SOT-23-3_L2.9-W1.6-P1.90-LS2.8-BR
  rect 1.07x0.6 smd: 1(1.235,-0.95) 2(1.235,0.95) 3(-1.235,0)
SW-TH_BTSA-X-P-16
  oval 1x0.7 hole 0.7x0.4: 1(-2.5,3) 2(0,3) 3(2.5,3) 4(-2.5,-3) 5(0,-3) 6(2.5,-3)
SW-TH_D2F-F
  rect 2x2 hole 1.4: 1(-5.079,-0.002)
  round 2 hole 1.4: 2(-0.002,0.002) 3(5.079,0.002)

## Nets
As in the schematic, except:
GND: C2.1 C3.1 C4.1 C5.1 C6.1 C9.1 C10.1 C11.1 C12.1 C13.1 CN1.2 D1.1 D2.1 H5.2 KEY1.1 KEY1.2 KEY2.1 KEY2.2 LED1.3 LED2.3 LED3.3 LED4.3 Q1.2 Q2.2 R5.1 R7.2 R8.1 R11.1 R13.2 R14.1 SW1.1 SW1#2.1 SW2.2 SW2.5 SW3.1 SW4.2 SW4.5 U1.7 U2.7 X1.2
PB2: KEY1.3 KEY1.4 KEY2.3 KEY2.4 Q2.1 R15.2 SW1.2 SW1#2.2 SW2.3 SW2.6 SW3.2 SW4.3 SW4.6 X1.6

Pads without a net: CN1 3 4; H5 3 4; R7 3; R13 3; SW1 3; SW1#2 3; SW2 1 4; SW3 3; SW4 1 4; X1 7 8

## Via types
v1: diameter 6, hole 5, Top Layer to Bottom Layer, 2 vias
v2: diameter 6, hole 5.1, Top Layer to Bottom Layer, 2 vias
v3: diameter 6, hole 5.2, Top Layer to Bottom Layer, 2 vias
v4: diameter 0.5, hole 0.3, Top Layer to Bottom Layer, 126 vias

## Routing (per net, layer and track width the routed paths; a pad name or vN(x,y) marks a point on that pad's centre or on a via; arc(x,y) is an arc through that point)
2.2V: length 135.6
  Top Layer w0.3: 61.66,7.1 60.17,8.59 60.17,13.39 ; 40.82,7.11 39.72,8.22 39.72,13.39 ; LED14.2 68.13,7.11 66.8,8.44 66.8,11.99 64.74,14.05 64.74,14.11 ; R2.2 43.43,38.54 ; 34.22,13.39 34.22,10.82 34.21,10.81 ; 41.14,13.39 41.07,13.32 41.07,10.81 ; 65.91,15.17 68.26,12.82 LED12.2 ; 32.83,13.39 32.83,8.5 34.21,7.12 ; LED11.2 61.65,13.36 61.68,13.39 ; 47.96,13.39 47.93,13.36 47.93,10.81 ; 46.49,13.39 46.49,8.55 47.98,7.06
  Top Layer w1: H1.1 27.31,13.39 64.03,13.39 67.18,16.55 67.18,32.57 64.39,35.36 46.61,35.36 43.43,38.54
2.2V_TEST: length 27.5
  Top Layer w0.3: R4.2 23.99,36.12 35.18,36.12 39.88,40.82 43.07,40.82 43.43,41.19 R2.1
  Top Layer w1: C3.2 43.43,41.19
3.2V: length 139.4
  Top Layer w0.3: 47.98,5.28 47.98,1.86 47.96,1.83 ; LED6.4 40.99,9.4 42.34,8.04 42.34,1.83 ; 61.7,1.83 61.66,1.87 61.66,5.46 ; 34.22,1.83 34.21,1.85 34.21,5.25 ; 49.41,1.83 49.41,8.05 47.93,9.53 ; 40.88,1.83 40.82,1.9 LED9.4 ; 34.21,9.41 35.61,8.01 35.61,1.83 ; 63.28,1.83 63.28,7.76 LED11.4 ; LED12.4 72.45,9.4 72.52,9.32 ; 68.33,5.61 68.33,2.01 68.5,1.83
  Top Layer w1: R1.2 70.72,39.19 69.72,38.19 69.72,13.64 72.52,10.85 72.52,4.75 69.6,1.83 27.56,1.83 H2.1
3.2V_TEST: length 27.3
  Top Layer w0.3: R10.2 52.25,37.01 64.52,37.01 68.69,41.19 R1.1
  Top Layer w1: R1.1 72.01,45 C10.2
3.3V: length 13.9
  Top Layer w0.5: X1.1 5.03,11.18 4.32,10.47 4.32,4.75 5.71,3.37 R15.1
+5V: length 108.7
  Top Layer w0.5: U2.2 55.81,52.24 56.18,52.62 R9.2 56.18,57.29 56.13,57.33 ; 27.7,57.33 27.7,53.54 R3.2 27.68,51.93 C2.2 27.29,51.55 U1.2
  Top Layer w1: 24.02,26.34 27.77,26.34 29.36,27.94 ; 24.02,26.34 24.04,26.32 LED2.1 ; 24.02,26.34 21.51,26.34 ; LED1.1 18.8,26.81 18.8,27.49 ; 21.51,26.34 19.94,26.34 18.8,27.49 ; 21.51,26.34 21.49,26.36 21.49,27.94 ; 18.8,27.49 18.8,32.69 11.56,39.93 11.56,51.66 CN1.1 17.23,57.33 56.13,57.33
GND: length 10.6
  Top Layer w0.6: v4(5.3,9.93) X1.2 v4(7.82,9.93)
  Top Layer w1: 29.04,20.42 LED2.3 28.89,21.12 v4(27.94,21.12) ; v4(24.36,32.09) LED3.3 24.51,31.39 v4(25.46,31.39) ; v4(20.45,21.12) 21.4,21.12 LED1.3 v4(21.55,20.42) ; v4(17.59,31.39) 16.64,31.39 16.49,31.24 v4(16.49,32.09)
  vias: v4(5.72,40.7) v4(6.94,39.97) v4(8.11,40.71) v4(21.15,47.96) v4(21.15,47.3) v4(21.15,46.67) v4(21.84,47.96) v4(21.84,47.3) v4(21.84,46.67) v4(21.97,52) v4(21.97,51.35) v4(22.54,47.96) v4(22.54,47.3) v4(22.54,46.67) v4(25.65,10.22) v4(25.65,9.33) v4(26.07,47.27) v4(26.07,46.61) v4(26.07,45.98) v4(26.54,10.22) v4(26.77,47.27) v4(26.77,46.61) v4(26.77,45.98) v4(27.46,47.27) v4(27.46,46.61) v4(27.46,45.98) v4(29.04,20.42) v4(30.3,51.36) v4(30.3,50.6) v4(30.86,51.36) v4(30.86,50.6) v4(31.42,51.36) v4(31.42,50.6) v4(31.98,51.36) v4(31.98,50.6) v4(39.82,49.2) v4(40.39,49.2) v4(40.95,49.2) v4(41.51,49.2) v4(42.49,49.2) v4(43.05,49.2) v4(43.61,49.2) v4(44.18,49.2) v4(49.6,48.73) v4(49.6,48.06) v4(49.6,47.43) v4(50.29,48.73) v4(50.29,48.06) v4(50.29,47.43) v4(50.42,52.63) v4(50.42,51.94) v4(50.98,48.73) v4(50.98,48.06) v4(50.98,47.43) v4(53.21,10.09) v4(53.21,9.2) v4(54.1,10.09) v4(54.58,47.97) v4(54.58,47.31) v4(54.58,46.67) v4(55.28,47.97) v4(55.28,47.31) v4(55.28,46.67) v4(55.97,47.97) v4(55.97,47.31) v4(55.97,46.67) v4(58.62,52.13) v4(58.62,51.36) v4(59.18,52.13) v4(59.18,51.36) v4(59.74,52.13) v4(59.74,51.36) v4(60.31,52.13) v4(60.31,51.36) v4(68.07,49.71) v4(68.63,49.71) v4(69.19,49.71) v4(69.76,49.71) v4(71.04,49.71) v4(71.6,49.71) v4(72.16,49.71) v4(72.72,49.71)
(no net):
  vias: v1(6,33.11) v1(94,33.11) v2(6,25.79) v2(94,25.79) v3(6,18.47) v3(94,18.47)
DIN: length 20.5
  Top Layer w0.2: 16.49,27.94 13.64,27.94 H6.1 13.59,34.85 9.02,39.43 9.02,41.33 8.39,41.96 H5.1
DOUT: length 5.6
  Top Layer w0.2: H7.1 13.59,22.41 14.73,21.27 LED1.2
PB0: length 83.8
  Top Layer w0.3: U1.3 26.02,52.37 26.03,52.38 26.03,53.39 R3.1 R5.2 24.5,54.42 24,54.92 21.84,54.92 H3.1
  Top Layer w0.4: X1.4 11.82,7.43 12.57,8.18 12.57,19.36 10.54,21.39 10.54,34.22 v4(7.11,37.65)
  Bottom Layer w0.4: v4(7.11,37.65) 4.7,40.06 4.7,42.09 10.03,47.43 10.03,53.9 13.33,57.21 19.05,57.21 20.45,55.81 H3.1
PB1: length 118.9
  Top Layer w0.3: U2.3 54.54,54.16 R9.1 R11.2 53,55 52.58,55.43 50.04,55.43 H4.1
  Top Layer w0.4: X1.5 12.48,6.18 13.72,7.42 13.72,19.74 11.43,22.03 11.43,34.85 v4(9.4,36.89)
  Bottom Layer w0.4: H4.1 48.9,56.19 46.48,58.6 12.83,58.6 9.02,54.79 9.02,47.55 3.68,42.22 3.68,39.81 6.6,36.89 v4(9.4,36.89)
PB2: length 134
  Top Layer w0.4: KEY1.4 50.26,21.2 SW1.2 51.53,26.34 52.83,26.34 53.25,26.77 SW2.6 47.59,27.45 ; v4(64.64,18.47) 59.06,18.47 v4(55.88,15.3) 55.37,15.8 50.67,15.8 47.78,18.7 ; SW4.6 79.62,24.95 SW3.2 ; 47.59,27.45 47.75,27.62 KEY1.3 ; 47.59,27.45 SW2.3 38.95,27.45 37.34,25.83 37.34,25.71 29.34,17.71 17.53,17.71 15.88,16.06 15.88,6.79 13.96,4.87 R15.2 9.34,4.93 X1.6 ; SW3.2 78.37,24.95 SW4.3 76.37,27.69 KEY2.3 ; SW3.2 79,21.07 KEY2.4 ; v4(55.88,10.6) 55.88,9.23 55.94,9.16
  Bottom Layer w0.4: KEY2.4 76.34,18.47 v4(64.64,18.47) ; v4(55.88,15.3) v4(55.88,10.6)
PC5: length 22.6
  Top Layer w0.4: v4(11.05,8.69) 11.04,8.68 X1.3 ; Q1.1 27.15,8.06 v4(18.03,8.06)
  Bottom Layer w0.4: v4(11.05,8.69) 17.4,8.69 v4(18.03,8.06)
$1N7140: length 4.9
  Top Layer w0.254: LED2.2 24.04,22.24 23.37,22.92 22.35,22.92 21.55,23.72 LED1.4
$1N7163: length 10.1
  Top Layer w0.254: LED3.2 29.44,31.17 30.61,31.17 31.37,30.41 31.37,25.33 30.61,24.57 LED2.4
$1N7186: length 5.3
  Top Layer w0.254: LED4.2 21.49,30.39 22.29,29.59 23.69,29.59 24.36,28.92 24.36,27.94
$1N21476: length 2.4
  Top Layer w0.3: C5.2 24.75,51.44 U1.4
$1N21483: length 7.8
  Top Layer w0.3: U1.5 24.75,42.59 23.88,41.71 23.88,41.21 R6.2 21.59,38.93 21.59,38.54 20.84,37.78 R4.1
$1N21484: length 9.2
  Top Layer w0.3: v4(29.97,42.22) 30.03,42.17 C1.2 ; v4(29.2,49.27) 29.16,49.31 U1.1
  Bottom Layer w0.3: v4(29.2,49.27) 29.97,48.5 v4(29.97,42.22)
$1N21485: length 2.9
  Top Layer w0.3: C1.1 28.56,41.08 U1.8
$1N21486: length 2.5
  Top Layer w0.3: R6.1 20.83,39.68 R7.1
$1N21488: length 5.6
  Top Layer w0.3: C7.2 26.78,41.86 26.41,42.23 26.02,42.23 ; 26.02,42.23 25.41,42.23 24.88,41.7 C6.2 ; 26.02,42.23 U1.6
$1N21489: length 1.9
  Top Layer w0.3: C7.1 26.78,37.77 R8.2
$1N22401: length 2.3
  Top Layer w0.3: C12.2 53.27,52.07 U2.4
$1N22408: length 7.9
  Top Layer w0.3: U2.5 53.27,43.29 52.32,42.35 52.32,41.84 50.97,40.49 R12.2 50.29,39.77 50.29,39.3 49.46,38.47 R10.1
$1N22409: length 9.4
  Top Layer w0.3: v4(57.71,49.97) 57.67,50.01 U2.1 ; v4(58.55,42.86) 58.55,41.6 C8.2
  Bottom Layer w0.3: v4(57.71,49.97) 58.55,49.14 v4(58.55,42.86)
$1N22410: length 3
  Top Layer w0.3: U2.8 57.14,44.54 C8.1
$1N22411: length 2.6
  Top Layer w0.3: R13.1 49.46,42.89 R12.1
$1N22413: length 5.2
  Top Layer w0.3: 54.54,43.18 55.3,42.42 C14.2 ; 54.54,43.18 53.52,42.17 C13.2 ; 54.54,43.18 U2.6
$1N22414: length 1.9
  Top Layer w0.3: R14.2 55.24,38.62 55.3,38.68 C14.1
$1N27439: length 48
  Top Layer w0.3: 31.21,5.58 31.21,5.25
  Top Layer w0.6: LED5.1 31.17,10.85 v4(30.1,10.85) ; v4(30.1,7.09) 31.2,7.09 LED8.1 ; v4(28.2,7.09) 27.93,6.82 27.91,6.82 ; LED9.1 37.82,7.1 v4(36.58,7.1) ; v4(36.58,10.89) 37.82,10.89 LED6.1 ; v4(36.58,9.37) 37.8,9.37 LED6.3 ; v4(30.1,5.62) 31.17,5.62 ; 31.17,5.62 31.21,5.58 ; 31.17,5.62 31.2,5.62 LED8.3 ; v4(30.1,9.33) 31.14,9.33 LED5.3 ; LED7.1 44.88,10.85 v4(43.69,10.85) ; Q1.3 27.91,6.82 ; 27.91,6.82 v4(28.19,6.53) ; v4(43.77,7.1) 44.92,7.1 LED10.1 ; LED7.3 44.86,9.33 v4(43.69,9.33) ; v4(36.58,5.6) 37.81,5.6 LED9.3 ; LED10.3 44.92,5.6 v4(43.77,5.6)
  Bottom Layer w0.6: v4(36.58,10.89) v4(36.58,9.37) v4(36.58,7.1) v4(36.58,5.6) ; v4(30.1,5.62) v4(30.1,7.09) v4(30.1,9.33) v4(30.1,10.85) ; v4(43.77,5.6) v4(43.77,7.1) 43.77,9.25 v4(43.69,9.33) v4(43.69,10.85)
  Bottom Layer w1: v4(43.77,7.1) v4(36.58,7.1) 36.57,7.09 v4(30.1,7.09) v4(28.2,7.09) 28.2,6.54 v4(28.19,6.53)
$1N27600: length 30
  Top Layer w0.6: LED11.1 58.61,10.85 v4(57.53,10.85) ; 55.41,6.69 Q2.3 ; 55.41,6.69 55.46,6.69 v4(55.75,6.41) ; 55.41,6.69 v4(55.75,7.04) ; v4(57.57,7.11) LED13.1 ; v4(57.56,9.4) LED11.3 ; LED14.1 v4(64.1,7.11) ; LED12.1 v4(64.1,10.9) ; v4(57.57,5.61) LED13.3 ; v4(64.1,9.3) 64.2,9.4 LED12.3 ; LED14.3 v4(64.15,5.61)
  Bottom Layer w0.6: v4(57.57,5.61) v4(57.57,7.11) 57.57,9.39 v4(57.56,9.4) 57.56,10.82 v4(57.53,10.85) ; v4(64.1,10.9) v4(64.1,9.3) 64.1,9.3 v4(64.1,7.11) 64.1,5.66 v4(64.15,5.61)
  Bottom Layer w1: v4(64.1,7.11) v4(57.57,7.11) 57.5,7.04 v4(55.75,7.04) v4(55.75,6.41)

## Copper pours and planes (outline as drawn; the poured copper is in the pictures)
2.2V_TEST on Top Layer: 36.96,45.39 44.7,45.39 44.7,42.98 36.96,42.98
3.2V_TEST on Top Layer: 65.28,46.03 73.28,46.03 73.28,43.74 65.28,43.74
GND on Top Layer: 20.57,52.32 44.83,52.32 44.83,42.81 20.57,42.81
GND on Top Layer: 48.83,52.96 73.41,52.96 73.41,43.49 48.83,43.49
GND on Top Layer: -4.7,63.56 103.25,63.56 103.25,-1.98 -4.7,-1.98
GND on Bottom Layer: -9.78,66.22 107.82,66.22 107.82,-5.66 -9.78,-5.66
$1N21485 on Top Layer: 28.07,45.39 34.93,45.39 34.93,42.86 28.07,42.86
$1N22410 on Top Layer: 56.77,46.19 63.25,46.19 63.25,43.49 56.77,43.49
